# Altium schematic sheet dac-layout - Copy.SchDoc: DAC
size A4; DrawnBy: Dylan Vogel; Organization: UTAT SS; DocumentNumber: 10; Revision: 1; SheetNumber: 10; SheetTotal: 11
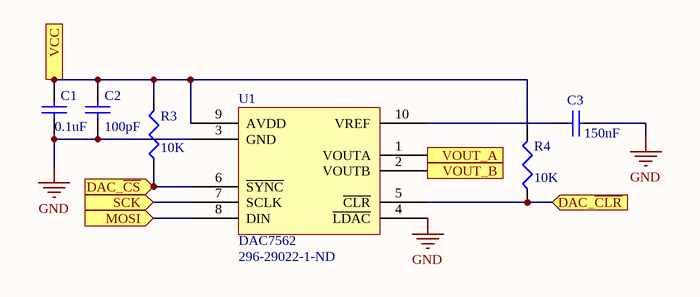
[diagram p0: dac-layout - Copy.SchDoc]

## Parts
C1  0.1uF  [0402]
C2  100pF  [0402]
C3  150nF  [0402]
R3  10K  [0402]
R4  10K  [0402]
U1  DAC7562  Supplier Part Number 1: 296-29022-1-ND  [SOP10-50P300X300-10N]

## Ports
DAC_~{CLR} (in), DAC_~{CS} (in), MOSI (in), SCK (in), VCC (in), VOUT_A (out), VOUT_B (out)

## Nets
GND: C1.1 C2.1 C3.2 U1.3(GND) U1.4(~{LDAC})
DAC_~{CLR}: R4.1 U1.5(~{CLR}) ; port DAC_~{CLR}
DAC_~{CS}: R3.1 U1.6(~{SYNC}) ; port DAC_~{CS}
MOSI: U1.8(DIN) ; port MOSI
SCK: U1.7(SCLK) ; port SCK
VCC: C1.2 C2.2 R3.2 R4.2 U1.9(AVDD) ; port VCC
VOUT_A: U1.1(VOUTA) ; port VOUT_A
VOUT_B: U1.2(VOUTB) ; port VOUT_B
NetC3_1: C3.1 U1.10(VREF)

## Library data of the parts
C1-C3 = Cap Semi: Capacitor (Semiconductor SIM Model); Published: 8-Jun-2000; LatestRevisionDate: 29-May-2009; LatestRevisionNote: IPC-7351 Footprint Added.; PackageReference: C1206; Publisher: Altium Limited; PackageDescription: Chip Capacitor; Supplier: Digi-Key
  C1: Value: 0.1uF; Supplier Part Number: 587-3807-1-ND
  C2: Value: 100pF; Supplier Part Number: 1276-1632-1-ND
  C3: Value: 150nF; Supplier Part Number: 1276-1972-1-ND
R3 R4 = Res3: Resistor; Published: 8-Jun-2000; LatestRevisionDate: 29-May-2009; LatestRevisionNote: IPC-7351 Footprint Added.; PackageReference: J1-0603; Publisher: Altium Limited; PackageDescription: Chip Resistor; Value: 10K; Supplier: Digi-Key
U1 = DAC7562: 12-bit, low-power, voltage-output DAC with internal reference.; Supplier 1: Digi-Key; Supplier: Digi-Key